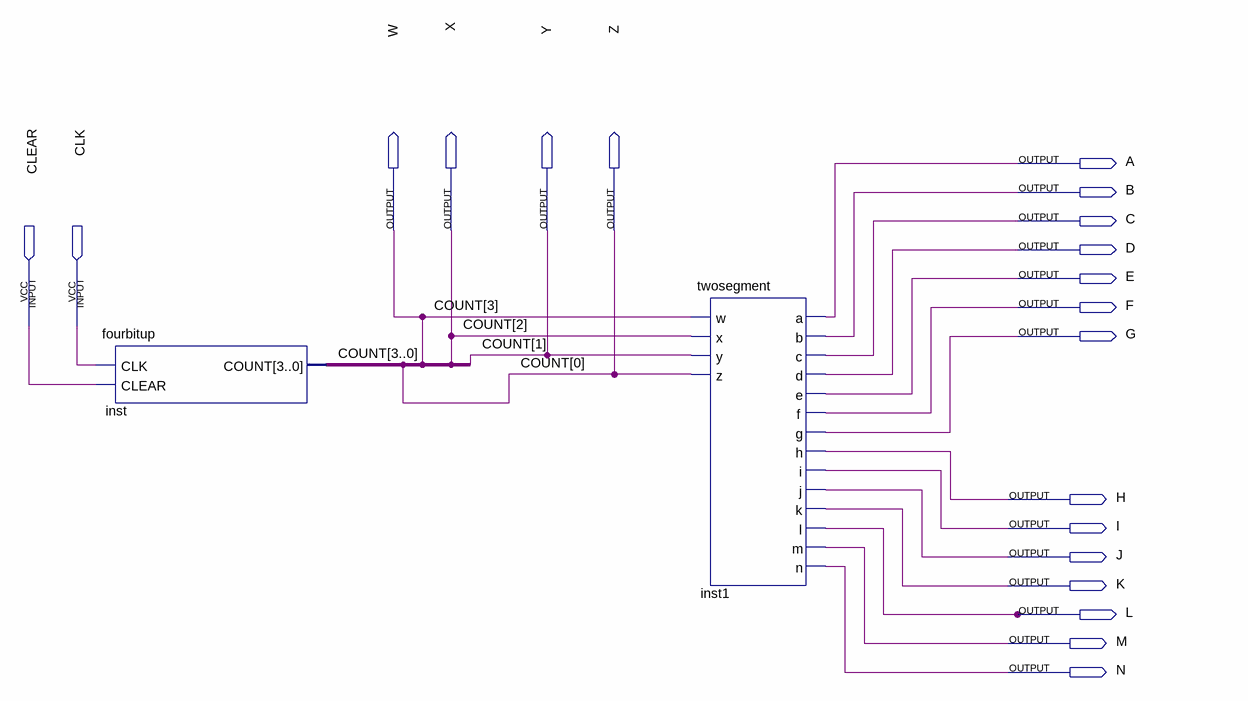
[diagram p0: schematic sheet]
// Quartus schematic fourbitdouble.bdf as structural Verilog: 2 symbols, 20 pins
module fourbitdouble (
  input  CLEAR,
  input  CLK,
  output A,
  output B,
  output C,
  output W,
  output X,
  output Y,
  output Z,
  output D,
  output E,
  output F,
  output G,
  output H,
  output I,
  output J,
  output K,
  output L,
  output M,
  output N
);

  fourbitup inst (.CLK(CLK), .CLEAR(CLEAR), .COUNT({W, X, Y, Z}));
  twosegment inst1 (
    .w(W), .x(X), .y(Y), .z(Z), .a(A), .b(B), .c(C), .d(D), .e(E), .f(F), .g(G), .h(H), .i(I), .j(J), .k(K),
    .l(L), .m(M), .n(N));

  // Other names for the same wires on the sheet: COUNT[3:0] = {W, X, Y, Z}
endmodule
